# Altium schematic sheet switches_place.SchDoc
size 839 x 594 mm; PageSetup: Record=PageOptions|CenterHorizontal=True|CenterVertical=True|PrintScale=0.94|XCorrection=1.00|YCorrection=1.00|PrintKind=1|BorderSize=5000000|LeftOffset=0|BottomOffset=0|Orientation=1|PaperLength=1000|PaperWidth=1000|Scale=100|PaperSource=7|PrintQuality=-4|MediaType=1|DitherType=10|PaperKind=A4|PrintScaleMode=1; DecimalNumber: Децимальный номер; HeadOfSector: Нач. сектора; MainDevice: Перв.примен.; Name: Наименование
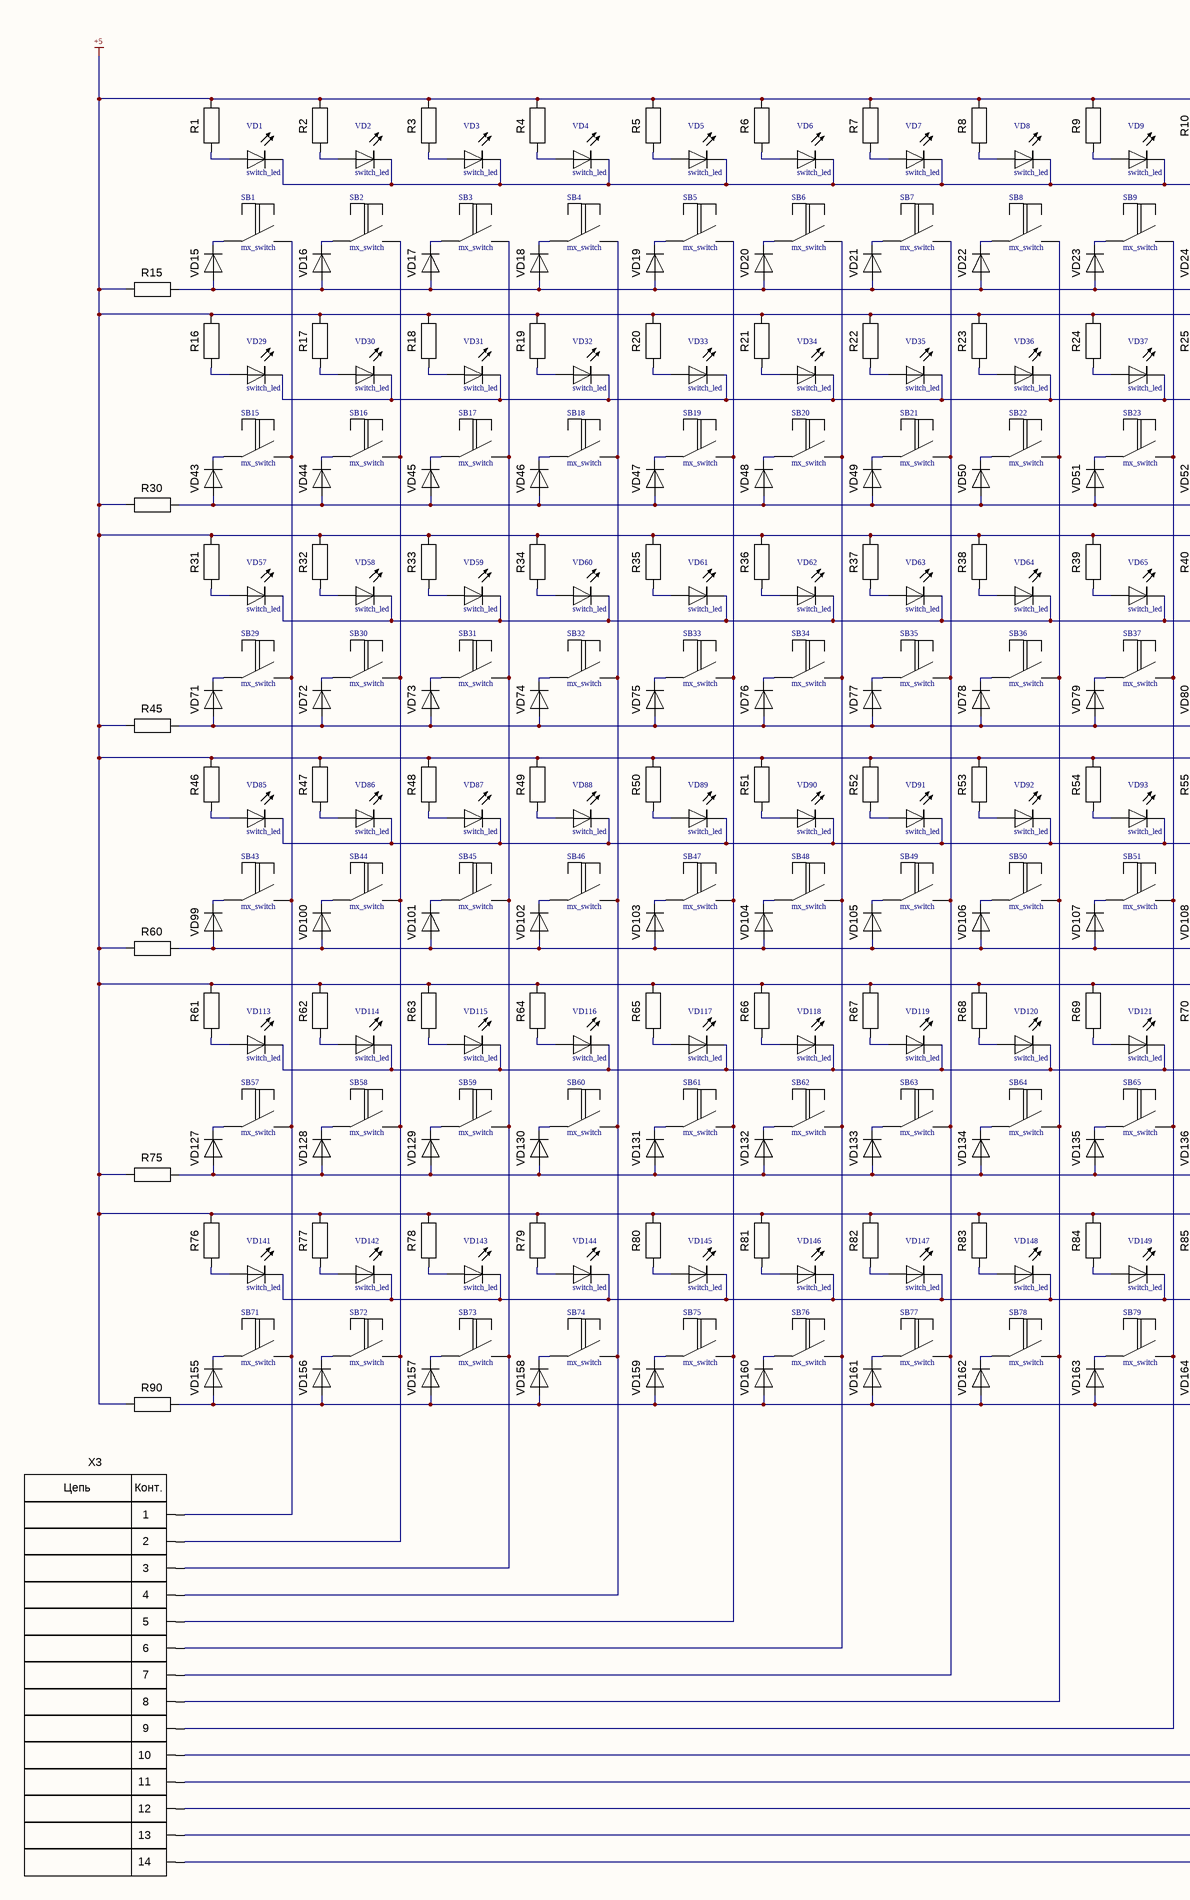
[diagram p0: switches_place.SchDoc, left]
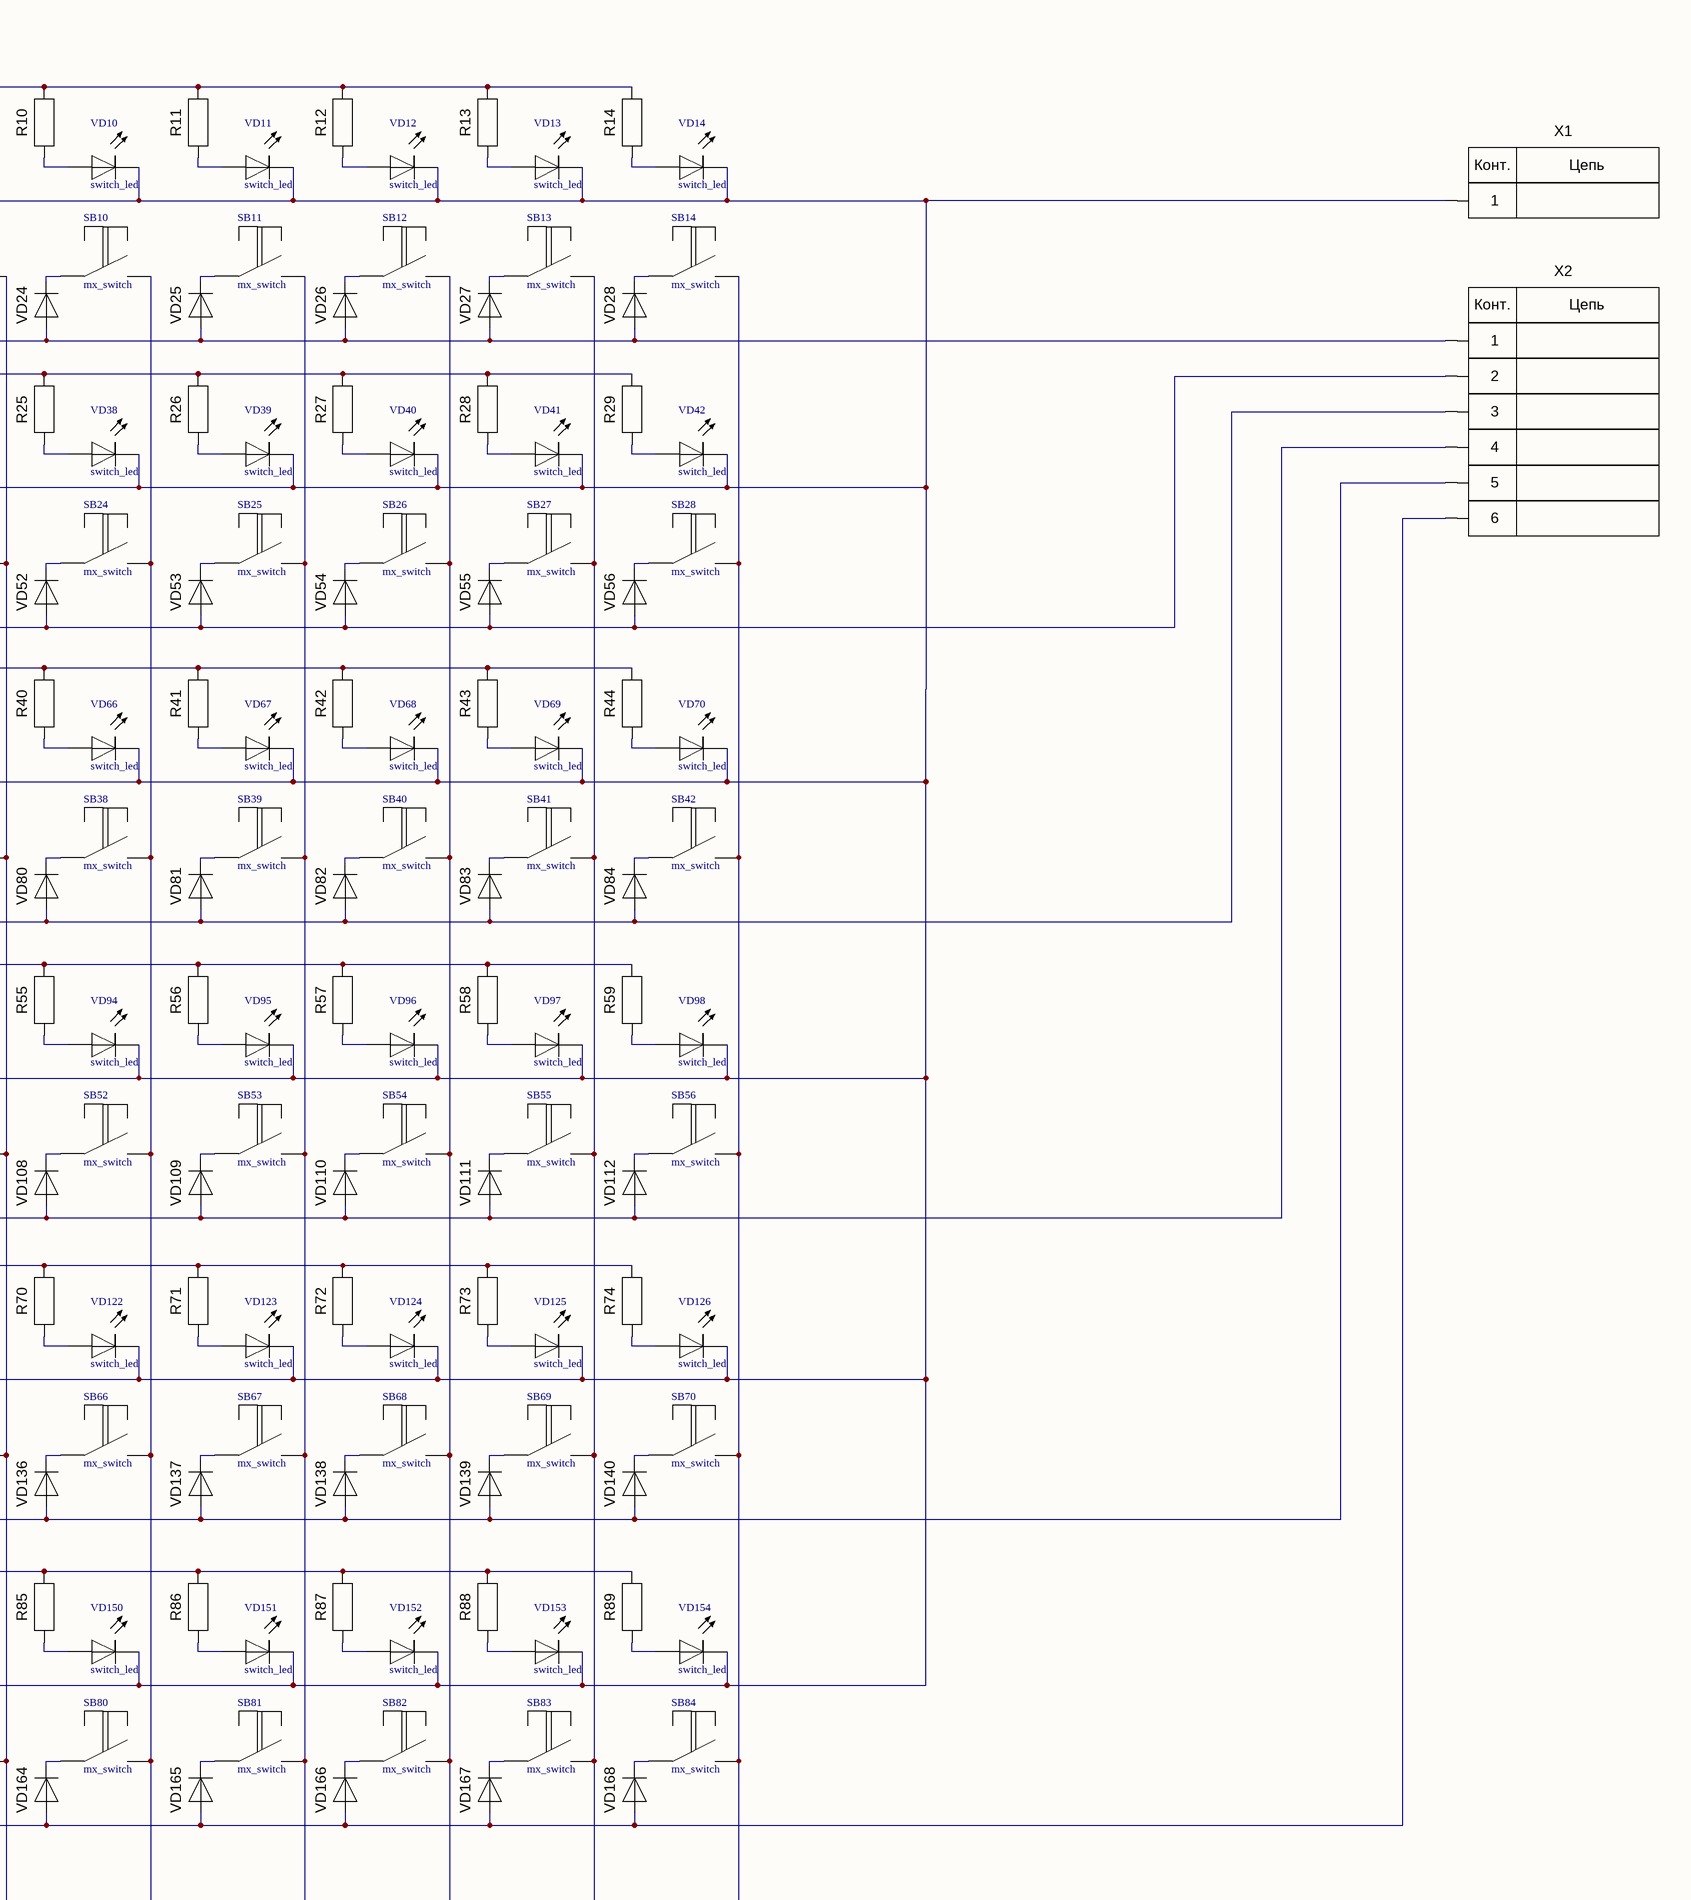
[diagram p1: switches_place.SchDoc, right]

## Parts
R1  R  [R_1206]  (value not drawn)
R2  R  [R_1206]  (value not drawn)
R3  R  [R_1206]  (value not drawn)
R4  R  [R_1206]  (value not drawn)
R5  R  [R_1206]  (value not drawn)
R6  R  [R_1206]  (value not drawn)
R7  R  [R_1206]  (value not drawn)
R8  R  [R_1206]  (value not drawn)
R9  R  [R_1206]  (value not drawn)
R10  R  [R_1206]  (value not drawn)
R11  R  [R_1206]  (value not drawn)
R12  R  [R_1206]  (value not drawn)
R13  R  [R_1206]  (value not drawn)
R14  R  [R_1206]  (value not drawn)
R15  R  [R_1206]  (value not drawn)
R16  R  [R_1206]  (value not drawn)
R17  R  [R_1206]  (value not drawn)
R18  R  [R_1206]  (value not drawn)
R19  R  [R_1206]  (value not drawn)
R20  R  [R_1206]  (value not drawn)
R21  R  [R_1206]  (value not drawn)
R22  R  [R_1206]  (value not drawn)
R23  R  [R_1206]  (value not drawn)
R24  R  [R_1206]  (value not drawn)
R25  R  [R_1206]  (value not drawn)
R26  R  [R_1206]  (value not drawn)
R27  R  [R_1206]  (value not drawn)
R28  R  [R_1206]  (value not drawn)
R29  R  [R_1206]  (value not drawn)
R30  R  [R_1206]  (value not drawn)
R31  R  [R_1206]  (value not drawn)
R32  R  [R_1206]  (value not drawn)
R33  R  [R_1206]  (value not drawn)
R34  R  [R_1206]  (value not drawn)
R35  R  [R_1206]  (value not drawn)
R36  R  [R_1206]  (value not drawn)
R37  R  [R_1206]  (value not drawn)
R38  R  [R_1206]  (value not drawn)
R39  R  [R_1206]  (value not drawn)
R40  R  [R_1206]  (value not drawn)
R41  R  [R_1206]  (value not drawn)
R42  R  [R_1206]  (value not drawn)
R43  R  [R_1206]  (value not drawn)
R44  R  [R_1206]  (value not drawn)
R45  R  [R_1206]  (value not drawn)
R46  R  [R_1206]  (value not drawn)
R47  R  [R_1206]  (value not drawn)
R48  R  [R_1206]  (value not drawn)
R49  R  [R_1206]  (value not drawn)
R50  R  [R_1206]  (value not drawn)
R51  R  [R_1206]  (value not drawn)
R52  R  [R_1206]  (value not drawn)
R53  R  [R_1206]  (value not drawn)
R54  R  [R_1206]  (value not drawn)
R55  R  [R_1206]  (value not drawn)
R56  R  [R_1206]  (value not drawn)
R57  R  [R_1206]  (value not drawn)
R58  R  [R_1206]  (value not drawn)
R59  R  [R_1206]  (value not drawn)
R60  R  [R_1206]  (value not drawn)
R61  R  [R_1206]  (value not drawn)
R62  R  [R_1206]  (value not drawn)
R63  R  [R_1206]  (value not drawn)
R64  R  [R_1206]  (value not drawn)
R65  R  [R_1206]  (value not drawn)
R66  R  [R_1206]  (value not drawn)
R67  R  [R_1206]  (value not drawn)
R68  R  [R_1206]  (value not drawn)
R69  R  [R_1206]  (value not drawn)
R70  R  [R_1206]  (value not drawn)
R71  R  [R_1206]  (value not drawn)
R72  R  [R_1206]  (value not drawn)
R73  R  [R_1206]  (value not drawn)
R74  R  [R_1206]  (value not drawn)
R75  R  [R_1206]  (value not drawn)
R76  R  [R_1206]  (value not drawn)
R77  R  [R_1206]  (value not drawn)
R78  R  [R_1206]  (value not drawn)
R79  R  [R_1206]  (value not drawn)
R80  R  [R_1206]  (value not drawn)
R81  R  [R_1206]  (value not drawn)
R82  R  [R_1206]  (value not drawn)
R83  R  [R_1206]  (value not drawn)
R84  R  [R_1206]  (value not drawn)
R85  R  [R_1206]  (value not drawn)
R86  R  [R_1206]  (value not drawn)
R87  R  [R_1206]  (value not drawn)
R88  R  [R_1206]  (value not drawn)
R89  R  [R_1206]  (value not drawn)
R90  R  [R_1206]  (value not drawn)
SB1  mx_switch  [cherry_mx_5pin_led]
SB2  mx_switch  [cherry_mx_5pin_led]
SB3  mx_switch  [cherry_mx_5pin_led]
SB4  mx_switch  [cherry_mx_5pin_led]
SB5  mx_switch  [cherry_mx_5pin_led]
SB6  mx_switch  [cherry_mx_5pin_led]
SB7  mx_switch  [cherry_mx_5pin_led]
SB8  mx_switch  [cherry_mx_5pin_led]
SB9  mx_switch  [cherry_mx_5pin_led]
SB10  mx_switch  [cherry_mx_5pin_led]
SB11  mx_switch  [cherry_mx_5pin_led]
SB12  mx_switch  [cherry_mx_5pin_led]
SB13  mx_switch  [cherry_mx_5pin_led]
SB14  mx_switch  [cherry_mx_5pin_led]
SB15  mx_switch  [cherry_mx_5pin_led]
SB16  mx_switch  [cherry_mx_5pin_led]
SB17  mx_switch  [cherry_mx_5pin_led]
SB18  mx_switch  [cherry_mx_5pin_led]
SB19  mx_switch  [cherry_mx_5pin_led]
SB20  mx_switch  [cherry_mx_5pin_led]
SB21  mx_switch  [cherry_mx_5pin_led]
SB22  mx_switch  [cherry_mx_5pin_led]
SB23  mx_switch  [cherry_mx_5pin_led]
SB24  mx_switch  [cherry_mx_5pin_led]
SB25  mx_switch  [cherry_mx_5pin_led]
SB26  mx_switch  [cherry_mx_5pin_led]
SB27  mx_switch  [cherry_mx_5pin_led]
SB28  mx_switch  [cherry_mx_5pin_led]
SB29  mx_switch  [cherry_mx_5pin_led]
SB30  mx_switch  [cherry_mx_5pin_led]
SB31  mx_switch  [cherry_mx_5pin_led]
SB32  mx_switch  [cherry_mx_5pin_led]
SB33  mx_switch  [cherry_mx_5pin_led]
SB34  mx_switch  [cherry_mx_5pin_led]
SB35  mx_switch  [cherry_mx_5pin_led]
SB36  mx_switch  [cherry_mx_5pin_led]
SB37  mx_switch  [cherry_mx_5pin_led]
SB38  mx_switch  [cherry_mx_5pin_led]
SB39  mx_switch  [cherry_mx_5pin_led]
SB40  mx_switch  [cherry_mx_5pin_led]
SB41  mx_switch  [cherry_mx_5pin_led]
SB42  mx_switch  [cherry_mx_5pin_led]
SB43  mx_switch  [cherry_mx_5pin_led]
SB44  mx_switch  [cherry_mx_5pin_led]
SB45  mx_switch  [cherry_mx_5pin_led]
SB46  mx_switch  [cherry_mx_5pin_led]
SB47  mx_switch  [cherry_mx_5pin_led]
SB48  mx_switch  [cherry_mx_5pin_led]
SB49  mx_switch  [cherry_mx_5pin_led]
SB50  mx_switch  [cherry_mx_5pin_led]
SB51  mx_switch  [cherry_mx_5pin_led]
SB52  mx_switch  [cherry_mx_5pin_led]
SB53  mx_switch  [cherry_mx_5pin_led]
SB54  mx_switch  [cherry_mx_5pin_led]
SB55  mx_switch  [cherry_mx_5pin_led]
SB56  mx_switch  [cherry_mx_5pin_led]
SB57  mx_switch  [cherry_mx_5pin_led]
SB58  mx_switch  [cherry_mx_5pin_led]
SB59  mx_switch  [cherry_mx_5pin_led]
SB60  mx_switch  [cherry_mx_5pin_led]
SB61  mx_switch  [cherry_mx_5pin_led]
SB62  mx_switch  [cherry_mx_5pin_led]
SB63  mx_switch  [cherry_mx_5pin_led]
SB64  mx_switch  [cherry_mx_5pin_led]
SB65  mx_switch  [cherry_mx_5pin_led]
SB66  mx_switch  [cherry_mx_5pin_led]
SB67  mx_switch  [cherry_mx_5pin_led]
SB68  mx_switch  [cherry_mx_5pin_led]
SB69  mx_switch  [cherry_mx_5pin_led]
SB70  mx_switch  [cherry_mx_5pin_led]
SB71  mx_switch  [cherry_mx_5pin_led]
SB72  mx_switch  [cherry_mx_5pin_led]
SB73  mx_switch  [cherry_mx_5pin_led]
SB74  mx_switch  [cherry_mx_5pin_led]
SB75  mx_switch  [cherry_mx_5pin_led]
SB76  mx_switch  [cherry_mx_5pin_led]
SB77  mx_switch  [cherry_mx_5pin_led]
SB78  mx_switch  [cherry_mx_5pin_led]
SB79  mx_switch  [cherry_mx_5pin_led]
SB80  mx_switch  [cherry_mx_5pin_led]
SB81  mx_switch  [cherry_mx_5pin_led]
SB82  mx_switch  [cherry_mx_5pin_led]
SB83  mx_switch  [cherry_mx_5pin_led]
SB84  mx_switch  [cherry_mx_5pin_led]
VD1  switch_led  [switch_led]
VD2  switch_led  [switch_led]
VD3  switch_led  [switch_led]
VD4  switch_led  [switch_led]
VD5  switch_led  [switch_led]
VD6  switch_led  [switch_led]
VD7  switch_led  [switch_led]
VD8  switch_led  [switch_led]
VD9  switch_led  [switch_led]
VD10  switch_led  [switch_led]
VD11  switch_led  [switch_led]
VD12  switch_led  [switch_led]
VD13  switch_led  [switch_led]
VD14  switch_led  [switch_led]
VD15  VD  [SMB]  (value not drawn)
VD16  VD  [SMB]  (value not drawn)
VD17  VD  [SMB]  (value not drawn)
VD18  VD  [SMB]  (value not drawn)
VD19  VD  [SMB]  (value not drawn)
VD20  VD  [SMB]  (value not drawn)
VD21  VD  [SMB]  (value not drawn)
VD22  VD  [SMB]  (value not drawn)
VD23  VD  [SMB]  (value not drawn)
VD24  VD  [SMB]  (value not drawn)
VD25  VD  [SMB]  (value not drawn)
VD26  VD  [SMB]  (value not drawn)
VD27  VD  [SMB]  (value not drawn)
VD28  VD  [SMB]  (value not drawn)
VD29  switch_led  [switch_led]
VD30  switch_led  [switch_led]
VD31  switch_led  [switch_led]
VD32  switch_led  [switch_led]
VD33  switch_led  [switch_led]
VD34  switch_led  [switch_led]
VD35  switch_led  [switch_led]
VD36  switch_led  [switch_led]
VD37  switch_led  [switch_led]
VD38  switch_led  [switch_led]
VD39  switch_led  [switch_led]
VD40  switch_led  [switch_led]
VD41  switch_led  [switch_led]
VD42  switch_led  [switch_led]
VD43  VD  [SMB]  (value not drawn)
VD44  VD  [SMB]  (value not drawn)
VD45  VD  [SMB]  (value not drawn)
VD46  VD  [SMB]  (value not drawn)
VD47  VD  [SMB]  (value not drawn)
VD48  VD  [SMB]  (value not drawn)
VD49  VD  [SMB]  (value not drawn)
VD50  VD  [SMB]  (value not drawn)
VD51  VD  [SMB]  (value not drawn)
VD52  VD  [SMB]  (value not drawn)
VD53  VD  [SMB]  (value not drawn)
VD54  VD  [SMB]  (value not drawn)
VD55  VD  [SMB]  (value not drawn)
VD56  VD  [SMB]  (value not drawn)
VD57  switch_led  [switch_led]
VD58  switch_led  [switch_led]
VD59  switch_led  [switch_led]
VD60  switch_led  [switch_led]
VD61  switch_led  [switch_led]
VD62  switch_led  [switch_led]
VD63  switch_led  [switch_led]
VD64  switch_led  [switch_led]
VD65  switch_led  [switch_led]
VD66  switch_led  [switch_led]
VD67  switch_led  [switch_led]
VD68  switch_led  [switch_led]
VD69  switch_led  [switch_led]
VD70  switch_led  [switch_led]
VD71  VD  [SMB]  (value not drawn)
VD72  VD  [SMB]  (value not drawn)
VD73  VD  [SMB]  (value not drawn)
VD74  VD  [SMB]  (value not drawn)
VD75  VD  [SMB]  (value not drawn)
VD76  VD  [SMB]  (value not drawn)
VD77  VD  [SMB]  (value not drawn)
VD78  VD  [SMB]  (value not drawn)
VD79  VD  [SMB]  (value not drawn)
VD80  VD  [SMB]  (value not drawn)
VD81  VD  [SMB]  (value not drawn)
VD82  VD  [SMB]  (value not drawn)
VD83  VD  [SMB]  (value not drawn)
VD84  VD  [SMB]  (value not drawn)
VD85  switch_led  [switch_led]
VD86  switch_led  [switch_led]
VD87  switch_led  [switch_led]
VD88  switch_led  [switch_led]
VD89  switch_led  [switch_led]
VD90  switch_led  [switch_led]
VD91  switch_led  [switch_led]
VD92  switch_led  [switch_led]
VD93  switch_led  [switch_led]
VD94  switch_led  [switch_led]
VD95  switch_led  [switch_led]
VD96  switch_led  [switch_led]
VD97  switch_led  [switch_led]
VD98  switch_led  [switch_led]
VD99  VD  [SMB]  (value not drawn)
VD100  VD  [SMB]  (value not drawn)
VD101  VD  [SMB]  (value not drawn)
VD102  VD  [SMB]  (value not drawn)
VD103  VD  [SMB]  (value not drawn)
VD104  VD  [SMB]  (value not drawn)
VD105  VD  [SMB]  (value not drawn)
VD106  VD  [SMB]  (value not drawn)
VD107  VD  [SMB]  (value not drawn)
VD108  VD  [SMB]  (value not drawn)
VD109  VD  [SMB]  (value not drawn)
VD110  VD  [SMB]  (value not drawn)
VD111  VD  [SMB]  (value not drawn)
VD112  VD  [SMB]  (value not drawn)
VD113  switch_led  [switch_led]
VD114  switch_led  [switch_led]
VD115  switch_led  [switch_led]
VD116  switch_led  [switch_led]
VD117  switch_led  [switch_led]
VD118  switch_led  [switch_led]
VD119  switch_led  [switch_led]
VD120  switch_led  [switch_led]
VD121  switch_led  [switch_led]
VD122  switch_led  [switch_led]
VD123  switch_led  [switch_led]
VD124  switch_led  [switch_led]
VD125  switch_led  [switch_led]
VD126  switch_led  [switch_led]
VD127  VD  [SMB]  (value not drawn)
VD128  VD  [SMB]  (value not drawn)
VD129  VD  [SMB]  (value not drawn)
VD130  VD  [SMB]  (value not drawn)
VD131  VD  [SMB]  (value not drawn)
VD132  VD  [SMB]  (value not drawn)
VD133  VD  [SMB]  (value not drawn)
VD134  VD  [SMB]  (value not drawn)
VD135  VD  [SMB]  (value not drawn)
VD136  VD  [SMB]  (value not drawn)
VD137  VD  [SMB]  (value not drawn)
VD138  VD  [SMB]  (value not drawn)
VD139  VD  [SMB]  (value not drawn)
VD140  VD  [SMB]  (value not drawn)
VD141  switch_led  [switch_led]
VD142  switch_led  [switch_led]
VD143  switch_led  [switch_led]
VD144  switch_led  [switch_led]
VD145  switch_led  [switch_led]
VD146  switch_led  [switch_led]
VD147  switch_led  [switch_led]
VD148  switch_led  [switch_led]
VD149  switch_led  [switch_led]
VD150  switch_led  [switch_led]
VD151  switch_led  [switch_led]
VD152  switch_led  [switch_led]
VD153  switch_led  [switch_led]
VD154  switch_led  [switch_led]
VD155  VD  [SMB]  (value not drawn)
VD156  VD  [SMB]  (value not drawn)
VD157  VD  [SMB]  (value not drawn)
VD158  VD  [SMB]  (value not drawn)
VD159  VD  [SMB]  (value not drawn)
VD160  VD  [SMB]  (value not drawn)
VD161  VD  [SMB]  (value not drawn)
VD162  VD  [SMB]  (value not drawn)
VD163  VD  [SMB]  (value not drawn)
VD164  VD  [SMB]  (value not drawn)
VD165  VD  [SMB]  (value not drawn)
VD166  VD  [SMB]  (value not drawn)
VD167  VD  [SMB]  (value not drawn)
VD168  VD  [SMB]  (value not drawn)
X1  X_1  [ZFKDSA_1,5-W-7,62]  (value not drawn)
X2  X_6  [1734753-1]  (value not drawn)
X3  X_14  [BH-14]  (value not drawn)

## Nets
+5: R1.2 R2.2 R3.2 R4.2 R5.2 R6.2 R7.2 R8.2 R9.2 R10.2 R11.2 R12.2 R13.2 R14.2 R15.1 R16.2 R17.2 R18.2 R19.2 R20.2 R21.2 R22.2 R23.2 R24.2 R25.2 R26.2 R27.2 R28.2 R29.2 R30.1 R31.2 R32.2 R33.2 R34.2 R35.2 R36.2 R37.2 R38.2 R39.2 R40.2 R41.2 R42.2 R43.2 R44.2 R45.1 R46.2 R47.2 R48.2 R49.2 R50.2 R51.2 R52.2 R53.2 R54.2 R55.2 R56.2 R57.2 R58.2 R59.2 R60.1 R61.2 R62.2 R63.2 R64.2 R65.2 R66.2 R67.2 R68.2 R69.2 R70.2 R71.2 R72.2 R73.2 R74.2 R75.1 R76.2 R77.2 R78.2 R79.2 R80.2 R81.2 R82.2 R83.2 R84.2 R85.2 R86.2 R87.2 R88.2 R89.2 R90.1
NetR1_1: R1.1 VD1.3
NetR2_1: R2.1 VD2.3
NetR3_1: R3.1 VD3.3
NetR4_1: R4.1 VD4.3
NetR5_1: R5.1 VD5.3
NetR6_1: R6.1 VD6.3
NetR7_1: R7.1 VD7.3
NetR8_1: R8.1 VD8.3
NetR9_1: R9.1 VD9.3
NetR10_1: R10.1 VD10.3
NetR11_1: R11.1 VD11.3
NetR12_1: R12.1 VD12.3
NetR13_1: R13.1 VD13.3
NetR14_1: R14.1 VD14.3
NetR15_2: R15.2 VD15.1(A) VD16.1(A) VD17.1(A) VD18.1(A) VD19.1(A) VD20.1(A) VD21.1(A) VD22.1(A) VD23.1(A) VD24.1(A) VD25.1(A) VD26.1(A) VD27.1(A) VD28.1(A) X2.1
NetR16_1: R16.1 VD29.3
NetR17_1: R17.1 VD30.3
NetR18_1: R18.1 VD31.3
NetR19_1: R19.1 VD32.3
NetR20_1: R20.1 VD33.3
NetR21_1: R21.1 VD34.3
NetR22_1: R22.1 VD35.3
NetR23_1: R23.1 VD36.3
NetR24_1: R24.1 VD37.3
NetR25_1: R25.1 VD38.3
NetR26_1: R26.1 VD39.3
NetR27_1: R27.1 VD40.3
NetR28_1: R28.1 VD41.3
NetR29_1: R29.1 VD42.3
NetR30_2: R30.2 VD43.1(A) VD44.1(A) VD45.1(A) VD46.1(A) VD47.1(A) VD48.1(A) VD49.1(A) VD50.1(A) VD51.1(A) VD52.1(A) VD53.1(A) VD54.1(A) VD55.1(A) VD56.1(A) X2.2
NetR31_1: R31.1 VD57.3
NetR32_1: R32.1 VD58.3
NetR33_1: R33.1 VD59.3
NetR34_1: R34.1 VD60.3
NetR35_1: R35.1 VD61.3
NetR36_1: R36.1 VD62.3
NetR37_1: R37.1 VD63.3
NetR38_1: R38.1 VD64.3
NetR39_1: R39.1 VD65.3
NetR40_1: R40.1 VD66.3
NetR41_1: R41.1 VD67.3
NetR42_1: R42.1 VD68.3
NetR43_1: R43.1 VD69.3
NetR44_1: R44.1 VD70.3
NetR45_2: R45.2 VD71.1(A) VD72.1(A) VD73.1(A) VD74.1(A) VD75.1(A) VD76.1(A) VD77.1(A) VD78.1(A) VD79.1(A) VD80.1(A) VD81.1(A) VD82.1(A) VD83.1(A) VD84.1(A) X2.3
NetR46_1: R46.1 VD85.3
NetR47_1: R47.1 VD86.3
NetR48_1: R48.1 VD87.3
NetR49_1: R49.1 VD88.3
NetR50_1: R50.1 VD89.3
NetR51_1: R51.1 VD90.3
NetR52_1: R52.1 VD91.3
NetR53_1: R53.1 VD92.3
NetR54_1: R54.1 VD93.3
NetR55_1: R55.1 VD94.3
NetR56_1: R56.1 VD95.3
NetR57_1: R57.1 VD96.3
NetR58_1: R58.1 VD97.3
NetR59_1: R59.1 VD98.3
NetR60_2: R60.2 VD99.1(A) VD100.1(A) VD101.1(A) VD102.1(A) VD103.1(A) VD104.1(A) VD105.1(A) VD106.1(A) VD107.1(A) VD108.1(A) VD109.1(A) VD110.1(A) VD111.1(A) VD112.1(A) X2.4
NetR61_1: R61.1 VD113.3
NetR62_1: R62.1 VD114.3
NetR63_1: R63.1 VD115.3
NetR64_1: R64.1 VD116.3
NetR65_1: R65.1 VD117.3
NetR66_1: R66.1 VD118.3
NetR67_1: R67.1 VD119.3
NetR68_1: R68.1 VD120.3
NetR69_1: R69.1 VD121.3
NetR70_1: R70.1 VD122.3
NetR71_1: R71.1 VD123.3
NetR72_1: R72.1 VD124.3
NetR73_1: R73.1 VD125.3
NetR74_1: R74.1 VD126.3
NetR75_2: R75.2 VD127.1(A) VD128.1(A) VD129.1(A) VD130.1(A) VD131.1(A) VD132.1(A) VD133.1(A) VD134.1(A) VD135.1(A) VD136.1(A) VD137.1(A) VD138.1(A) VD139.1(A) VD140.1(A) X2.5
NetR76_1: R76.1 VD141.3
NetR77_1: R77.1 VD142.3
NetR78_1: R78.1 VD143.3
NetR79_1: R79.1 VD144.3
NetR80_1: R80.1 VD145.3
NetR81_1: R81.1 VD146.3
NetR82_1: R82.1 VD147.3
NetR83_1: R83.1 VD148.3
NetR84_1: R84.1 VD149.3
NetR85_1: R85.1 VD150.3
NetR86_1: R86.1 VD151.3
NetR87_1: R87.1 VD152.3
NetR88_1: R88.1 VD153.3
NetR89_1: R89.1 VD154.3
NetR90_2: R90.2 VD155.1(A) VD156.1(A) VD157.1(A) VD158.1(A) VD159.1(A) VD160.1(A) VD161.1(A) VD162.1(A) VD163.1(A) VD164.1(A) VD165.1(A) VD166.1(A) VD167.1(A) VD168.1(A) X2.6
NetSB1_1: SB1.1 VD15.2(C)
NetSB1_2: SB1.2 SB15.2 SB29.2 SB43.2 SB57.2 SB71.2 X3.1
NetSB2_1: SB2.1 VD16.2(C)
NetSB2_2: SB2.2 SB16.2 SB30.2 SB44.2 SB58.2 SB72.2 X3.2
NetSB3_1: SB3.1 VD17.2(C)
NetSB3_2: SB3.2 SB17.2 SB31.2 SB45.2 SB59.2 SB73.2 X3.3
NetSB4_1: SB4.1 VD18.2(C)
NetSB4_2: SB4.2 SB18.2 SB32.2 SB46.2 SB60.2 SB74.2 X3.4
NetSB5_1: SB5.1 VD19.2(C)
NetSB5_2: SB5.2 SB19.2 SB33.2 SB47.2 SB61.2 SB75.2 X3.5
NetSB6_1: SB6.1 VD20.2(C)
NetSB6_2: SB6.2 SB20.2 SB34.2 SB48.2 SB62.2 SB76.2 X3.6
NetSB7_1: SB7.1 VD21.2(C)
NetSB7_2: SB7.2 SB21.2 SB35.2 SB49.2 SB63.2 SB77.2 X3.7
NetSB8_1: SB8.1 VD22.2(C)
NetSB8_2: SB8.2 SB22.2 SB36.2 SB50.2 SB64.2 SB78.2 X3.8
NetSB9_1: SB9.1 VD23.2(C)
NetSB9_2: SB9.2 SB23.2 SB37.2 SB51.2 SB65.2 SB79.2 X3.9
NetSB10_1: SB10.1 VD24.2(C)
NetSB10_2: SB10.2 SB24.2 SB38.2 SB52.2 SB66.2 SB80.2 X3.10
NetSB11_1: SB11.1 VD25.2(C)
NetSB11_2: SB11.2 SB25.2 SB39.2 SB53.2 SB67.2 SB81.2 X3.11
NetSB12_1: SB12.1 VD26.2(C)
NetSB12_2: SB12.2 SB26.2 SB40.2 SB54.2 SB68.2 SB82.2 X3.12
NetSB13_1: SB13.1 VD27.2(C)
NetSB13_2: SB13.2 SB27.2 SB41.2 SB55.2 SB69.2 SB83.2 X3.13
NetSB14_1: SB14.1 VD28.2(C)
NetSB14_2: SB14.2 SB28.2 SB42.2 SB56.2 SB70.2 SB84.2 X3.14
NetSB15_1: SB15.1 VD43.2(C)
NetSB16_1: SB16.1 VD44.2(C)
NetSB17_1: SB17.1 VD45.2(C)
NetSB18_1: SB18.1 VD46.2(C)
NetSB19_1: SB19.1 VD47.2(C)
NetSB20_1: SB20.1 VD48.2(C)
NetSB21_1: SB21.1 VD49.2(C)
NetSB22_1: SB22.1 VD50.2(C)
NetSB23_1: SB23.1 VD51.2(C)
NetSB24_1: SB24.1 VD52.2(C)
NetSB25_1: SB25.1 VD53.2(C)
NetSB26_1: SB26.1 VD54.2(C)
NetSB27_1: SB27.1 VD55.2(C)
NetSB28_1: SB28.1 VD56.2(C)
NetSB29_1: SB29.1 VD71.2(C)
NetSB30_1: SB30.1 VD72.2(C)
NetSB31_1: SB31.1 VD73.2(C)
NetSB32_1: SB32.1 VD74.2(C)
NetSB33_1: SB33.1 VD75.2(C)
NetSB34_1: SB34.1 VD76.2(C)
NetSB35_1: SB35.1 VD77.2(C)
NetSB36_1: SB36.1 VD78.2(C)
NetSB37_1: SB37.1 VD79.2(C)
NetSB38_1: SB38.1 VD80.2(C)
NetSB39_1: SB39.1 VD81.2(C)
NetSB40_1: SB40.1 VD82.2(C)
NetSB41_1: SB41.1 VD83.2(C)
NetSB42_1: SB42.1 VD84.2(C)
NetSB43_1: SB43.1 VD99.2(C)
NetSB44_1: SB44.1 VD100.2(C)
NetSB45_1: SB45.1 VD101.2(C)
NetSB46_1: SB46.1 VD102.2(C)
NetSB47_1: SB47.1 VD103.2(C)
NetSB48_1: SB48.1 VD104.2(C)
NetSB49_1: SB49.1 VD105.2(C)
NetSB50_1: SB50.1 VD106.2(C)
NetSB51_1: SB51.1 VD107.2(C)
NetSB52_1: SB52.1 VD108.2(C)
NetSB53_1: SB53.1 VD109.2(C)
NetSB54_1: SB54.1 VD110.2(C)
NetSB55_1: SB55.1 VD111.2(C)
NetSB56_1: SB56.1 VD112.2(C)
NetSB57_1: SB57.1 VD127.2(C)
NetSB58_1: SB58.1 VD128.2(C)
NetSB59_1: SB59.1 VD129.2(C)
NetSB60_1: SB60.1 VD130.2(C)
NetSB61_1: SB61.1 VD131.2(C)
NetSB62_1: SB62.1 VD132.2(C)
NetSB63_1: SB63.1 VD133.2(C)
NetSB64_1: SB64.1 VD134.2(C)
NetSB65_1: SB65.1 VD135.2(C)
NetSB66_1: SB66.1 VD136.2(C)
NetSB67_1: SB67.1 VD137.2(C)
NetSB68_1: SB68.1 VD138.2(C)
NetSB69_1: SB69.1 VD139.2(C)
NetSB70_1: SB70.1 VD140.2(C)
NetSB71_1: SB71.1 VD155.2(C)
NetSB72_1: SB72.1 VD156.2(C)
NetSB73_1: SB73.1 VD157.2(C)
NetSB74_1: SB74.1 VD158.2(C)
NetSB75_1: SB75.1 VD159.2(C)
NetSB76_1: SB76.1 VD160.2(C)
NetSB77_1: SB77.1 VD161.2(C)
NetSB78_1: SB78.1 VD162.2(C)
NetSB79_1: SB79.1 VD163.2(C)
NetSB80_1: SB80.1 VD164.2(C)
NetSB81_1: SB81.1 VD165.2(C)
NetSB82_1: SB82.1 VD166.2(C)
NetSB83_1: SB83.1 VD167.2(C)
NetSB84_1: SB84.1 VD168.2(C)
NetVD1_4: VD1.4 VD2.4 VD3.4 VD4.4 VD5.4 VD6.4 VD7.4 VD8.4 VD9.4 VD10.4 VD11.4 VD12.4 VD13.4 VD14.4 VD29.4 VD30.4 VD31.4 VD32.4 VD33.4 VD34.4 VD35.4 VD36.4 VD37.4 VD38.4 VD39.4 VD40.4 VD41.4 VD42.4 VD57.4 VD58.4 VD59.4 VD60.4 VD61.4 VD62.4 VD63.4 VD64.4 VD65.4 VD66.4 VD67.4 VD68.4 VD69.4 VD70.4 VD85.4 VD86.4 VD87.4 VD88.4 VD89.4 VD90.4 VD91.4 VD92.4 VD93.4 VD94.4 VD95.4 VD96.4 VD97.4 VD98.4 VD113.4 VD114.4 VD115.4 VD116.4 VD117.4 VD118.4 VD119.4 VD120.4 VD121.4 VD122.4 VD123.4 VD124.4 VD125.4 VD126.4 VD141.4 VD142.4 VD143.4 VD144.4 VD145.4 VD146.4 VD147.4 VD148.4 VD149.4 VD150.4 VD151.4 VD152.4 VD153.4 VD154.4 X1.1

## Notes on the sheet
- Перв.примен.
- Справ.№
- Подп. и дата
- Инв.№ дубл.
- Взам.инв.№
- Подп.и дата
- Разраб.
- Изм.
- Лист
- № докум.
- Подп.
- Дата
- Лит.
- Масштаб
- Масса
- Т.контр.
- Пров.
- СХЕМА   ЭЛЕКТРИЧЕСКАЯ
- ПРИНЦИПИАЛЬНАЯ
- Листов
- Инв.№ подл.
- Утв.
- Н.контр.
- Нач.сект.
- Формат  A1
- (in symbol Вилка BH-14) Цепь; Конт.
- (in symbol Колодка клеммная ZFKDSA 1,5-W-7,62) Конт.; Цепь
- (in symbol Розетка 1734753-1) Конт.; Цепь

## Library data of the parts
R1-R14 R16-R29 R31-R44 R46-R59 R61-R74 R76-R89 = Резистор RC1206FR-0728KL (28 кОм +-1%): Resistance: 28k; Tolerance: ±1%; Power: 0.25 W; Maximum Working Voltage: 200V; Maximum Overload Voltage: 400V; Part Number: Резистор RC1206FR-0728KL (28 кОм +-1%); HelpURL: http://www.yageo.ru/pdf/RC1206.pdf
R15 R30 R45 R60 R75 R90 = Резистор RC1206FR-0716K5L (16.5 кОм +-1%): Resistance: 16k5; Tolerance: ±1%; Power: 0.25 W; Maximum Working Voltage: 200V; Maximum Overload Voltage: 400V; Part Number: Резистор RC1206FR-0716K5L (16.5 кОм +-1%); HelpURL: http://www.yageo.ru/pdf/RC1206.pdf
VD15-VD28 VD43-VD56 VD71-VD84 VD99-VD112 VD127-VD140 VD155-VD168 = Диод 10BQ040PbF: Reverse Voltage: 40 V; Forward Current: 1 A; Peak Current: 430 A; Part Number: Диод 10BQ040PbF; HelpURL: http://www.irf.com/product-info/datasheets/data/10bq40.pdf; Recovery Time: -
X1 = Колодка клеммная ZFKDSA 1,5-W-7,62: Part Number: Колодка клеммная ZFKDSA 1,5-W-7,62; HelpURL: https://www.phoenixcontact.com/online/portal/us?uri=pxc-oc-itemdetail:pid=1706730&library=usen&tab=1
X2 = Розетка 1734753-1: Part Number: Розетка 1734753-1; HelpURL: http://www.te.com/usa-en/product-1734753-1.html
X3 = Вилка BH-14: Part Number: Вилка BH-14; HelpURL: http://www.brownbear.ru/components/bh-14.html